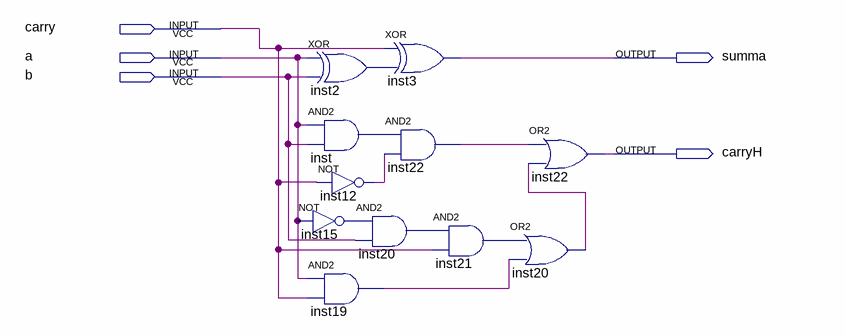
[diagram p0: schematic sheet]
// Quartus schematic Summator_1bit.bdf as structural Verilog: 11 symbols, 5 pins
module Summator_1bit (
  input  carry,
  input  a,
  input  b,
  output summa,
  output carryH
);

  wire inst2_out, inst12_out, inst15_out, inst19_out, inst20_out, inst20_out_2, inst21_out, inst22_out,
       inst_out;

  xor inst2 (inst2_out, a, b);
  and inst (inst_out, a, b);
  not inst12 (inst12_out, carry);
  not inst15 (inst15_out, a);
  and inst19 (inst19_out, a, carry);
  xor inst3 (summa, carry, inst2_out);
  and inst22 (inst22_out, inst_out, inst12_out);
  and inst20 (inst20_out_2, inst15_out, b);
  and inst21 (inst21_out, inst20_out_2, carry);
  or inst22_dup2 (carryH, inst22_out, inst20_out);
  or inst20_dup2 (inst20_out, inst21_out, inst19_out);
endmodule
